# Altium schematic sheet Finger Vein.SchDoc
size A4
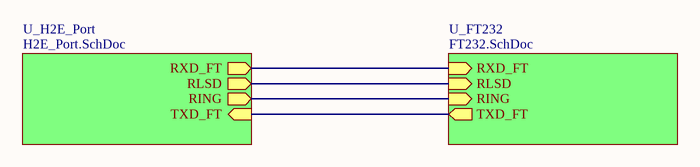
[diagram p0: Finger Vein.SchDoc]

## Sub-sheets
U_FT232 = FT232.SchDoc: TXD_FT (out), RXD_FT (in), RLSD (in), RING (in)
U_H2E_Port = H2E_Port.SchDoc: TXD_FT (in), RXD_FT (out), RLSD (out), RING (out)

## Nets
(unnamed): sheet U_FT232/TXD_FT, sheet U_H2E_Port/TXD_FT
(unnamed): sheet U_FT232/RXD_FT, sheet U_H2E_Port/RXD_FT
(unnamed): sheet U_FT232/RLSD, sheet U_H2E_Port/RLSD
(unnamed): sheet U_FT232/RING, sheet U_H2E_Port/RING